# EAGLE schematic USB French Bar 2 (EAGLE 7.6.0)
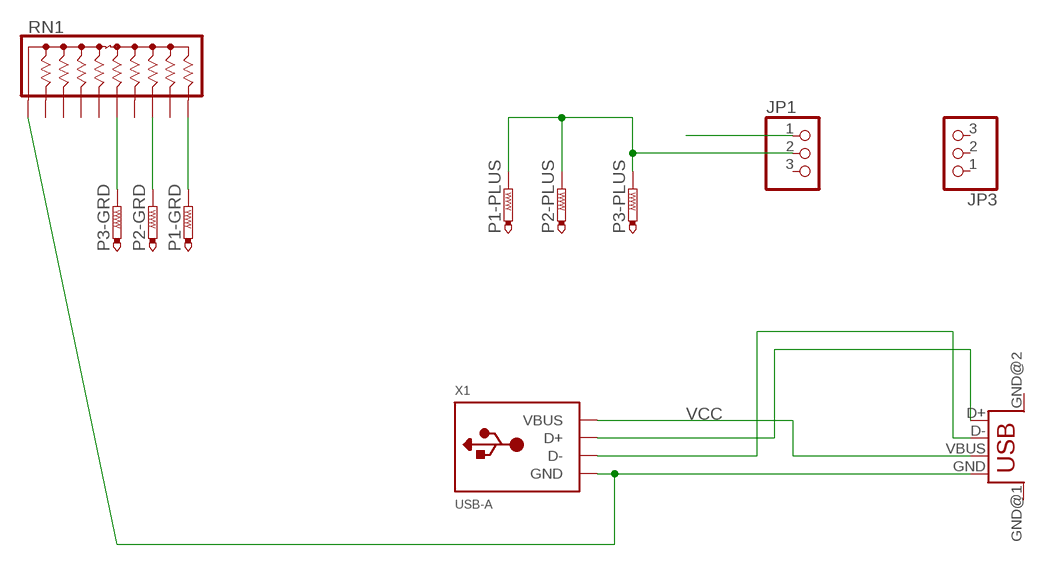
[diagram p0: schematic, sheet 1]

## Parts
JP1  PINHD-1X3  [1X03]
JP3  PINHD-1X3  [1X03]
P1-GRD  PTR1TP20SQ  [TP20SQ]
P1-PLUS  PTR1TP20SQ  [TP20SQ]
P2-GRD  PTR1TP20SQ  [TP20SQ]
P2-PLUS  PTR1TP20SQ  [TP20SQ]
P3-GRD  PTR1TP20SQ  [TP20SQ]
P3-PLUS  PTR1TP20SQ  [TP20SQ]
RN1  4610X  [SIP10]
U$1  USB  [USB-FEMALE-A-PTH]
X1  USB-A  [MOLEX_480371000]

## Nets
N$1: RN1.1 U$1.GND X1.4(GND)
N$2: P1-GRD.TP RN1.10
N$3: U$1.D+ X1.3(D+)
N$4: U$1.D- X1.2(D-)
N$5: P2-GRD.TP RN1.8
N$6: P3-GRD.TP RN1.6
N$7: JP1.2 P1-PLUS.TP P2-PLUS.TP P3-PLUS.TP
VCC: JP1.1 U$1.VBUS X1.1(VBUS)
Unconnected: JP1.3 JP3.1 JP3.2 JP3.3 RN1.2 RN1.3 RN1.4 RN1.5 RN1.7 RN1.9 U$1.GND@1(GND) U$1.GND@2(GND)

## Library data of the parts
JP1 JP3 = adafruit:PINHD-1X3: PIN HEADER
P1-GRD P1-PLUS P2-GRD P2-PLUS P3-GRD P3-PLUS = testpad:PTR1: TEST PIN
RN1 = resistor-sip:4610X: Bourns 4600X Series - Thick Film Conformal SIPs 4610X-101 Resistor Network Configuration: 101 (Bussed Resistors) Resistance range: 10 ohms to 10 Megaohms Maximum Operating Voltage: 100V Source: http://www.bourns.com/ProductLine.aspx?name=standard_thick_film_networks PDF: http://www.bourns.com/data/global/pdfs/4600X.pdf
U$1 = STUNTAZ:USB: USB Connectors USB-FEMALE-A-PTH: Through hole Female Type A Connector
X1 = adafruit:USB-A: USB type A 'plug' Used for things that can directly connect to a USB port, say USB key